# EasyEDA schematic 1-Schematic_TRD Line follower robot.json
TITLE: New Schematic; REV: 1.0; Date: 2018-11-09; Sheet: 1/1; Drawn By: Martinlinux
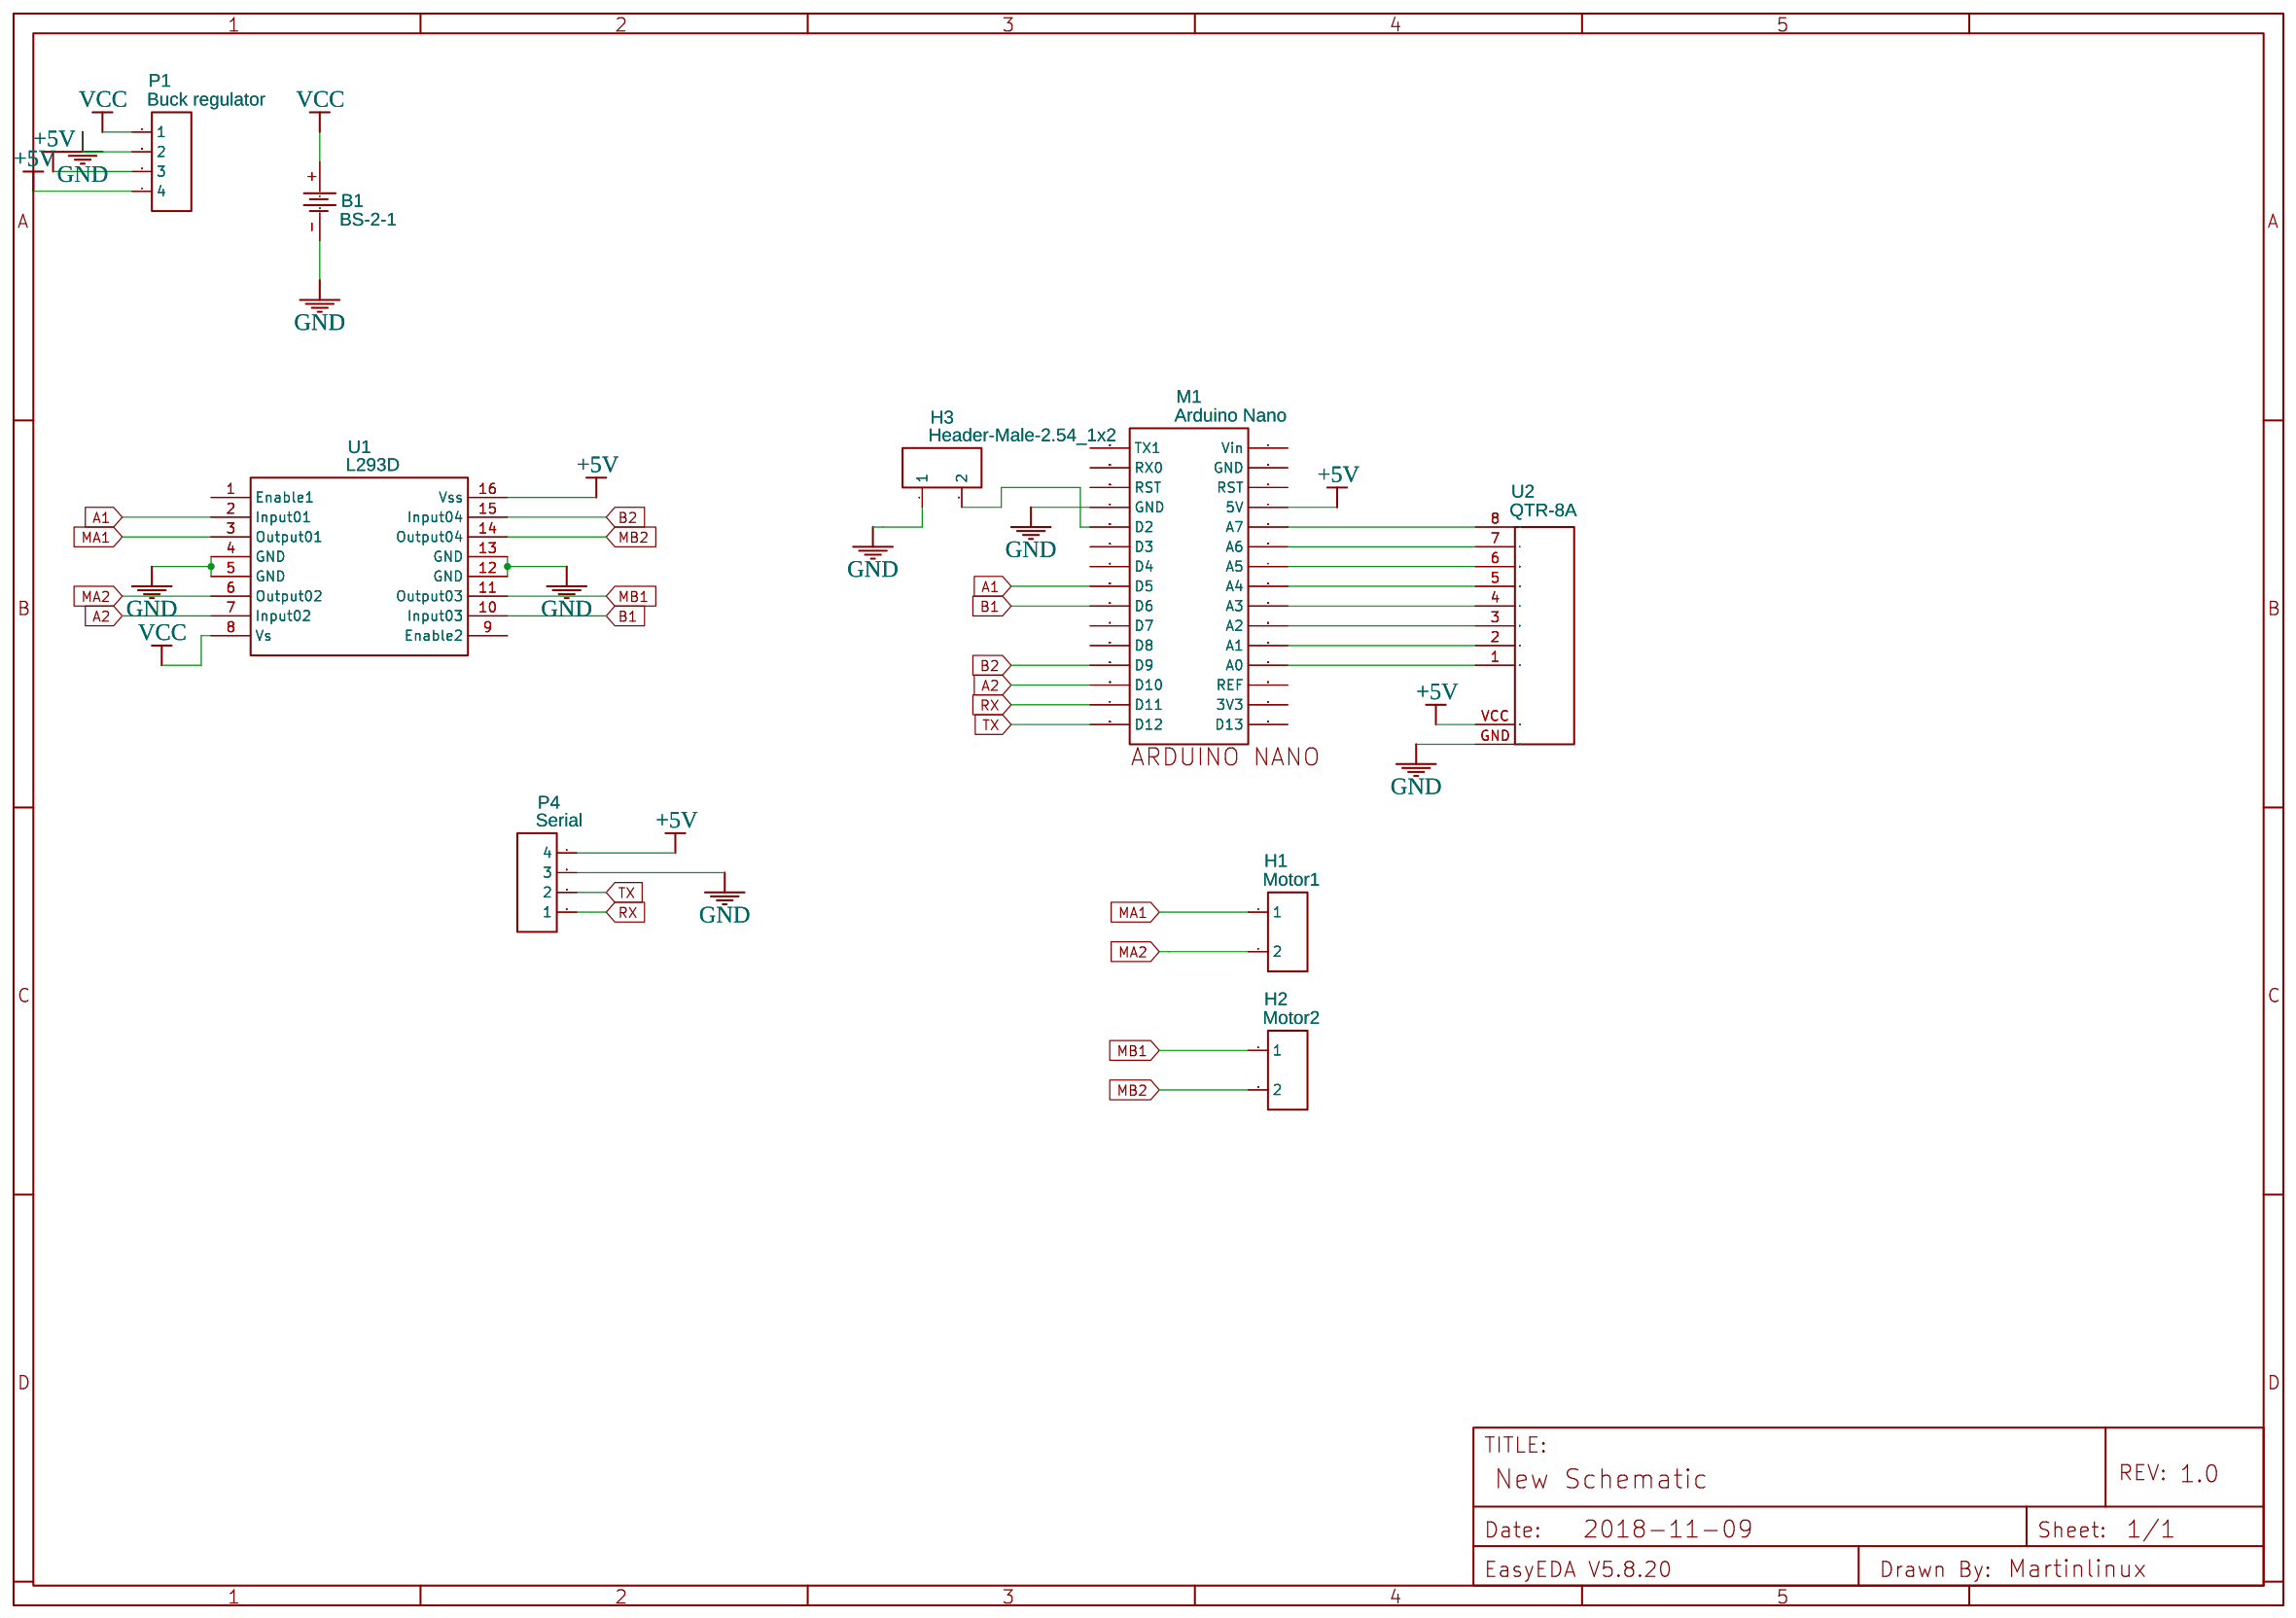
[diagram p0: schematic sheet]

## Parts
B1  BS-2-1  [DEANS]
H1  Motor1  [HDR-2X1/2.54]
H2  Motor2  [HDR-2X1/2.54]
H3  Header-Male-2.54_1x2  [HDR-2X1/2.54]
M1  Arduino Nano  [ARDUINO NANO]
P1  Buck regulator  [HDR-4X1/2.54]
P4  Serial  [HDR-4X1/2.54]
U1  L293D  [DIP-16]
U2  QTR-8A  [QTR-8A]

## Library data of the parts
B1 = -: Supplier Part: C70376; Supplier: LCSC; Manufacturer: Q&J; image: //image.lceda.cn/szlcsc/C70376.jpg
H1-H3 = -: Supplier: LCSC; Manufacturer: TE Connectivity; Manufacturer Part: 826629-2; image: //image.lceda.cn/szlcsc/C86471.jpg; Supplier Part: C86471
M1 = -: Contributor: hctan22
P1 P4 = -: Supplier Part: C124413; Supplier: LCSC; Manufacturer: ReliaPro; Manufacturer Part: Header-Female-2.54_1x4
U1 = -: Contributor: pitreluc; Supplier: LCSC; Manufacturer: STMicroelectronics; image: //image.lceda.cn/szlcsc/C12340.jpg; Supplier Part: C12340
U2 = -: Contributor: sndjulian; Manufacturer Part: ?

## Nets
+5V: M1.4(5V) P1.3 P1.4 P4.4 U1.16(Vss) U2.VCC(9)
GND: B1.-(2) H3.1 M1.27(GND) P1.2 P4.3 U1.4(GND) U1.5(GND) U1.12(GND) U1.13(GND) U2.GND(1)
VCC: B1.+(1) P1.1 U1.8(Vs)
A1: M1.23(D5) U1.2(Input01)
A2: M1.18(D10) U1.7(Input02)
B1: M1.22(D6) U1.10(Input03)
B2: M1.19(D9) U1.15(Input04)
MA1: H1.1 U1.3(Output01)
MA2: H1.2 U1.6(Output02)
MB1: H2.1 U1.11(Output03)
MB2: H2.2 U1.14(Output04)
RX: M1.17(D11) P4.1
TX: M1.16(D12) P4.2
M1_5: M1.5(A7) U2.8
M1_6: M1.6(A6) U2.7
M1_7: M1.7(A5) U2.6
M1_8: M1.8(A4) U2.5
M1_9: M1.9(A3) U2.4
M1_10: M1.10(A2) U2.3
M1_11: M1.11(A1) U2.2
M1_12: M1.12(A0) U2.1
M1_26: H3.2 M1.26(D2)

Not connected (* = marked no-connect by the designer): M1 1(Vin) 2(GND) 3(RST) 13(REF) 14(3V3) 15(D13) 20(D8) 21(D7) 24(D4) 25(D3) 28(RST) 29(RX0) 30(TX1); U1 1(Enable1) 9(Enable2)
